# Altium schematic sheet MotorCell.SchDoc
size A3; SheetNumber: 2
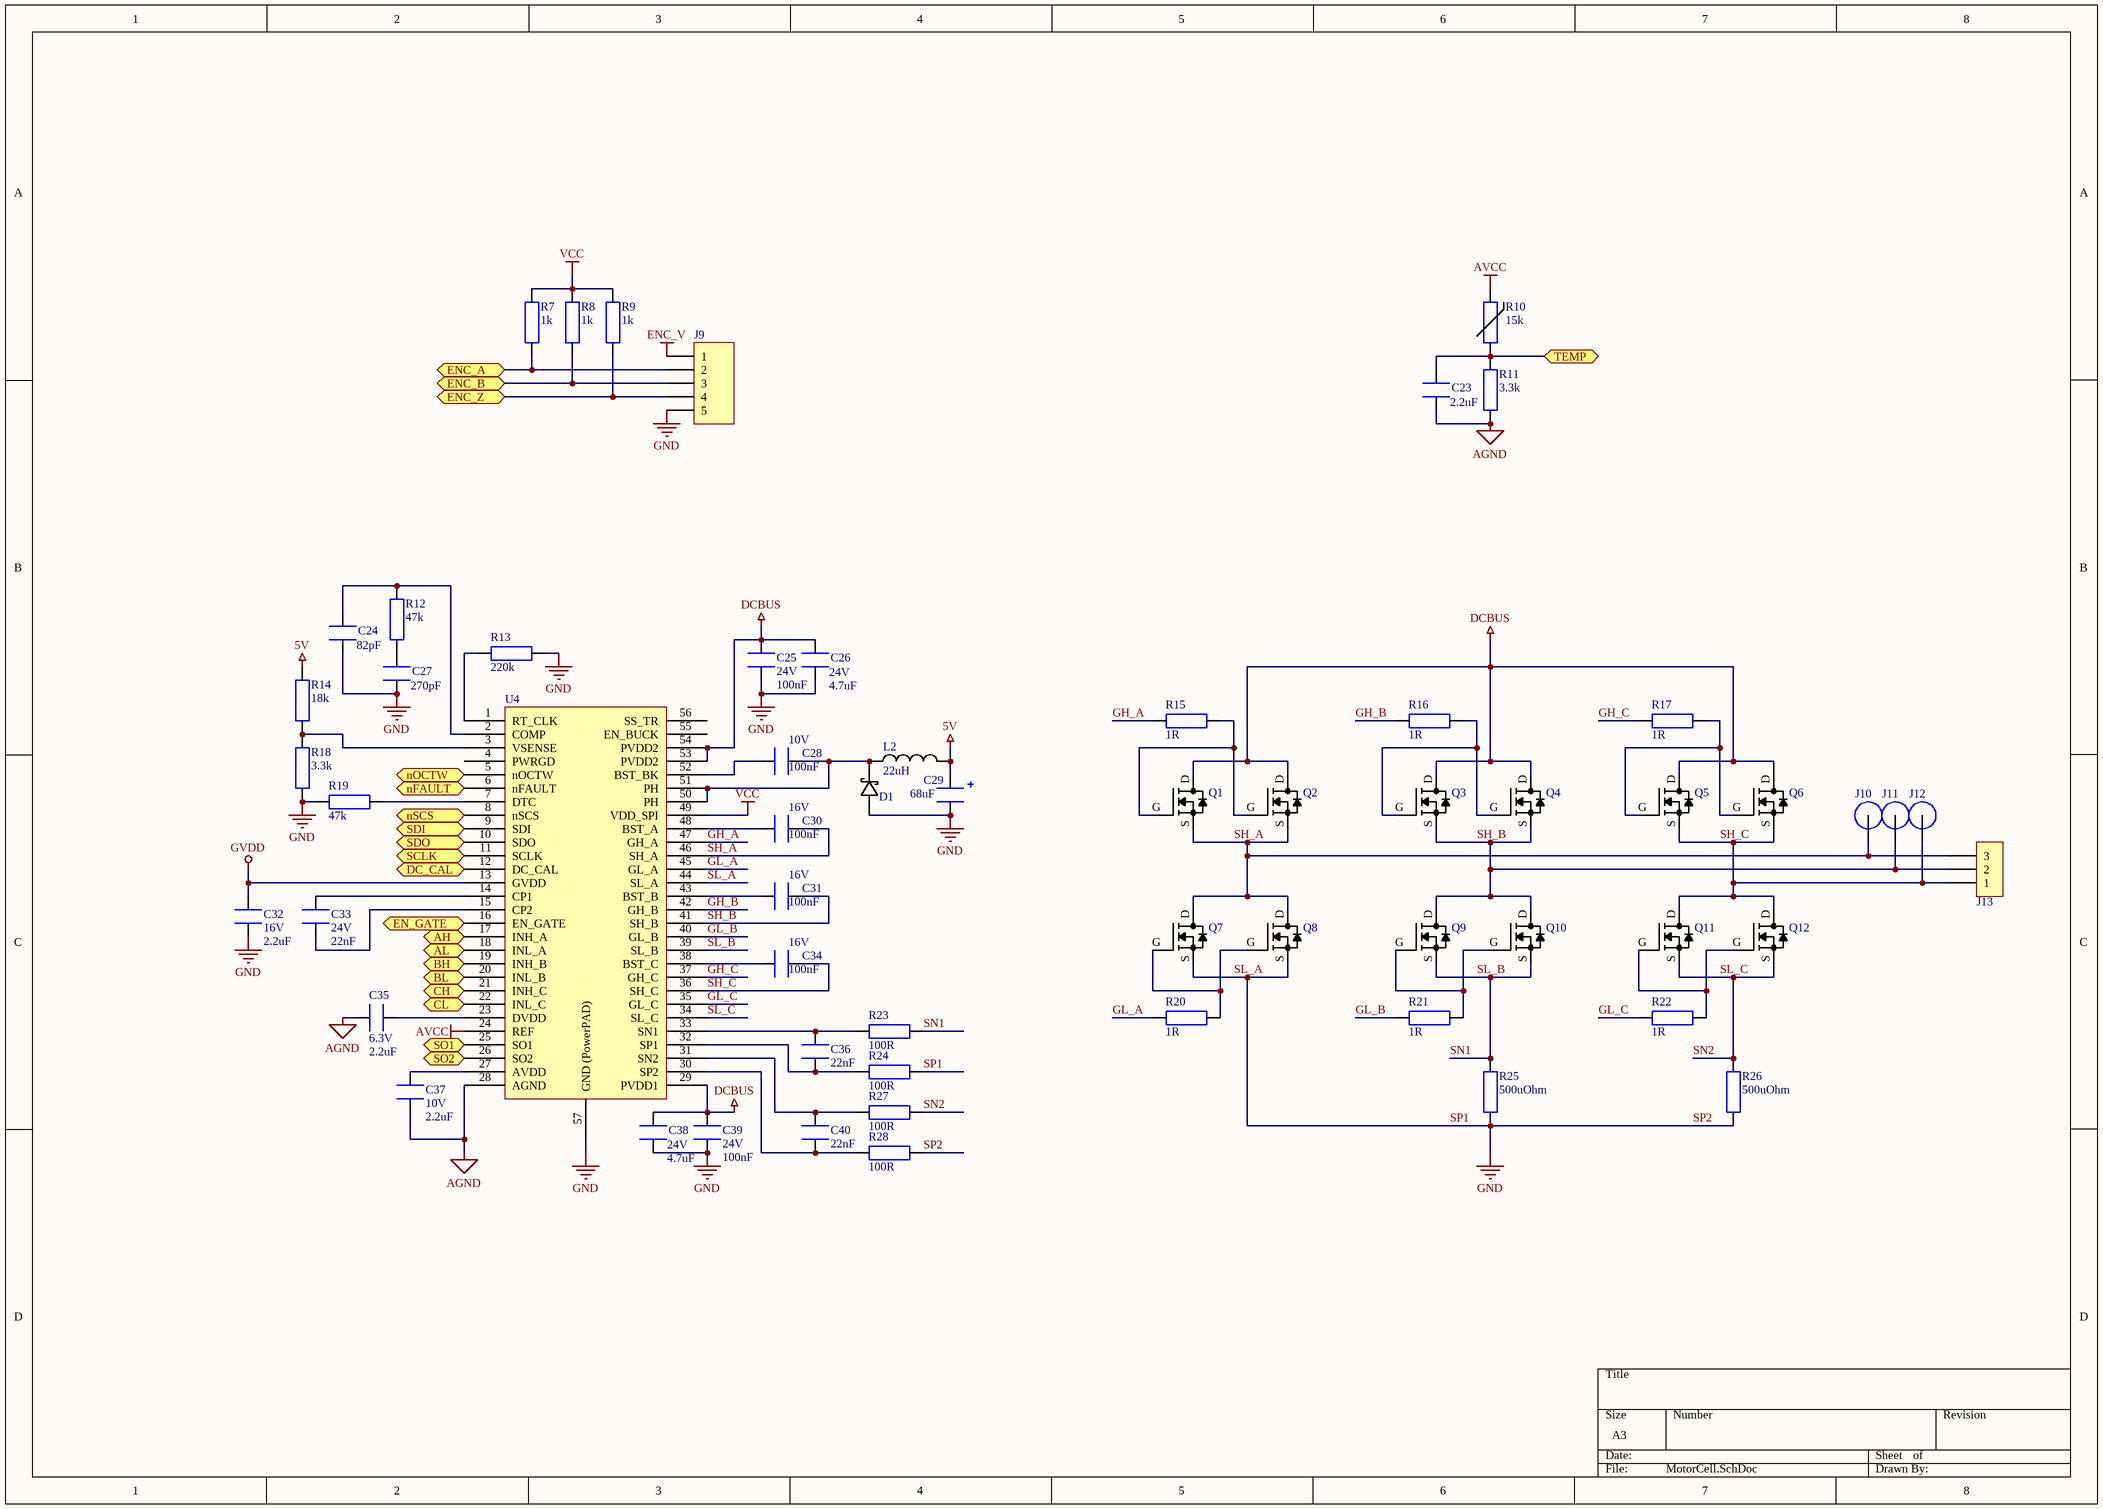
[diagram p0: MotorCell.SchDoc]

## Parts
C23  value 2.2uF  [1608[0603]]
C24  value 82pF  [1608[0603]]
C25  24V  value 100nF  [1608[0603]]
C26  24V  value 4.7uF  [CAPC2012X09N]
C27  value 270pF  [1608[0603]]
C28  10V  value 100nF  [1608[0603]]
C29  value 68uF  [CAPCP6032X28N]
C30  16V  value 100nF  [1608[0603]]
C31  16V  value 100nF  [1608[0603]]
C32  16V  value 2.2uF  [1608[0603]]
C33  24V  value 22nF  [1608[0603]]
C34  16V  value 100nF  [1608[0603]]
C35  6.3V  value 2.2uF  [1608[0603]]
C36  value 22nF  [1608[0603]]
C37  10V  value 2.2uF  [1608[0603]]
C38  24V  value 4.7uF  [CAPC2012X09N]
C39  24V  value 100nF  [1608[0603]]
C40  value 22nF  [1608[0603]]
D1  (no value)  [DO-214AA]
J9  (no value)  [HDR1X5]
J10  (no value)  [M3 Spade Hole]
J11  (no value)  [M3 Spade Hole]
J12  (no value)  [M3 Spade Hole]
J13  (no value)  [MC000051]
L2  value 22uH  [INDC6060X28N]
Q1  (no value)  [SO8FL]
Q2  (no value)  [SO8FL_FILL]
Q3  (no value)  [SO8FL]
Q4  (no value)  [SO8FL_FILL]
Q5  (no value)  [SO8FL]
Q6  (no value)  [SO8FL_FILL]
Q7  (no value)  [SO8FL]
Q8  (no value)  [SO8FL]
Q9  (no value)  [SO8FL]
Q10  (no value)  [SO8FL]
Q11  (no value)  [SO8FL]
Q12  (no value)  [SO8FL]
R7  value 1k  [RESC1608X55N]
R8  value 1k  [RESC1608X55N]
R9  value 1k  [RESC1608X55N]
R10  value 15k  [RESC1608X06L]
R11  value 3.3k  [RESC1608X55N]
R12  value 47k  [RESC1608X55N]
R13  value 220k  [RESC1608X55N]
R14  value 18k  [RESC1608X55N]
R15  value 1R  [RESC1608X55N]
R16  value 1R  [RESC1608X55N]
R17  value 1R  [RESC1608X55N]
R18  value 3.3k  [RESC1608X55N]
R19  value 47k  [RESC1608X55N]
R20  value 1R  [RESC1608X55N]
R21  value 1R  [RESC1608X55N]
R22  value 1R  [RESC1608X55N]
R23  value 100R  [RESC1608X55N]
R24  value 100R  [RESC1608X55N]
R25  value 500uOhm  [RESC6432X09N]
R26  value 500uOhm  [RESC6432X09N]
R27  value 100R  [RESC1608X55N]
R28  value 100R  [RESC1608X55N]
U4  (no value)  [TSSOP50P810X120_HS-57N]

## Ports
AH, AL, BH, BL, CH, CL, DC_CAL, EN_GATE, ENC_A, ENC_B, ENC_Z, nFAULT, nOCTW, nSCS, SCLK, SDI, SDO, SO1, SO2, TEMP

## Nets
5V: C29.1 L2.2 R14.1
AGND: C23.1 C35.1 C37.1 R11.2 U4.28(AGND)
AVCC: R10.2 U4.24(REF)
DCBUS: C25.1 C26.2 C38.2 C39.1 Q1.D Q2.D Q3.D Q4.D Q5.D Q6.D U4.29(PVDD1) U4.53(PVDD2) U4.54(PVDD2)
ENC_V: J9.1
GVDD: C32.2 U4.13(GVDD)
SL_A: C24.2 C25.2 C26.1 C27.2 C29.2 C32.1 C38.1 C39.2 D1.A J9.5 Q7.S Q8.S R13.2 R18.2 R19.2 R24.1 R25.1 R26.1 R28.1 U4.44(SL_A) U4.57(GND_(PowerPAD))  [also labelled GND, SP1, SP2]
VCC: R7.1 R8.1 R9.1 U4.49(VDD_SPI)
AH: U4.17(INH_A) ; port AH
AL: U4.18(INL_A) ; port AL
BH: U4.19(INH_B) ; port BH
BL: U4.20(INL_B) ; port BL
CH: U4.21(INH_C) ; port CH
CL: U4.22(INL_C) ; port CL
DC_CAL: U4.12(DC_CAL) ; port DC_CAL
EN_GATE: U4.16(EN_GATE) ; port EN_GATE
ENC_A: J9.2 R7.2 ; port ENC_A
ENC_B: J9.3 R8.2 ; port ENC_B
ENC_Z: J9.4 R9.2 ; port ENC_Z
GH_A: R15.1 U4.47(GH_A)
GH_B: R16.1 U4.42(GH_B)
GH_C: R17.1 U4.37(GH_C)
GL_A: R20.1 U4.45(GL_A)
GL_B: R21.1 U4.40(GL_B)
GL_C: R22.1 U4.35(GL_C)
nFAULT: U4.6(nFAULT) ; port nFAULT
nOCTW: U4.5(nOCTW) ; port nOCTW
nSCS: U4.8(nSCS) ; port nSCS
SCLK: U4.11(SCLK) ; port SCLK
SDI: U4.9(SDI) ; port SDI
SDO: U4.10(SDO) ; port SDO
SH_A: C30.1 J10.1 J13.3 Q1.S Q2.S Q7.D Q8.D U4.46(SH_A)
SH_B: C31.1 J11.1 J13.2 Q3.S Q4.S Q9.D Q10.D U4.41(SH_B)
SH_C: C34.1 J12.1 J13.1 Q5.S Q6.S Q11.D Q12.D U4.36(SH_C)
SL_B: Q9.S Q10.S R23.1 R25.2 U4.39(SL_B)  [also labelled SN1]
SL_C: Q11.S Q12.S R26.2 R27.1 U4.34(SL_C)  [also labelled SN2]
SO1: U4.25(SO1) ; port SO1
SO2: U4.26(SO2) ; port SO2
TEMP: C23.2 R10.1 R11.1 ; port TEMP
NetC24_1: C24.1 R12.1 U4.2(COMP)
NetC27_1: C27.1 R12.2
NetC28_1: C28.1 D1.K L2.1 U4.50(PH) U4.51(PH)
NetC28_2: C28.2 U4.52(BST_BK)
NetC30_2: C30.2 U4.48(BST_A)
NetC31_2: C31.2 U4.43(BST_B)
NetC33_1: C33.1 U4.14(CP1)
NetC33_2: C33.2 U4.15(CP2)
NetC34_2: C34.2 U4.38(BST_C)
NetC35_2: C35.2 U4.23(DVDD)
NetC36_1: C36.1 R23.2 U4.33(SN1)
NetC36_2: C36.2 R24.2 U4.32(SP1)
NetC37_2: C37.2 U4.27(AVDD)
NetC40_1: C40.1 R27.2 U4.31(SN2)
NetC40_2: C40.2 R28.2 U4.30(SP2)
NetQ1_G: Q1.G Q2.G R15.2
NetQ3_G: Q3.G Q4.G R16.2
NetQ5_G: Q5.G Q6.G R17.2
NetQ7_G: Q7.G Q8.G R20.2
NetQ9_G: Q9.G Q10.G R21.2
NetQ11_G: Q11.G Q12.G R22.2
NetR13_1: R13.1 U4.1(RT_CLK)
NetR14_2: R14.2 R18.1 U4.3(VSENSE)
NetR19_1: R19.1 U4.7(DTC)

Not connected (* = marked no-connect by the designer): U4 4(PWRGD) 55(EN_BUCK) 56(SS_TR)

## Library data of the parts
C23-C25 C27 C28 C30-C37 C39 C40 = CAP_0603: CAP General 0603
C26 C38 = GRM219R6YA475KA73D: CAP CER 4.7UF 35V X5R 0805
C29 = T495C686M016ATE250: CAP TANT 68UF 16V 20% 2312 250mOhm
D1 = SS13B: DIODE, SCHOTTK, RECTIF, 1A, 30V, SMB; Supplier 1: Farnell; Supplier Part Number 1: 1861425
J9 = Header 5: Header, 5-Pin; LatestRevisionDate: 17-Jul-2002; LatestRevisionNote: Re-released for DXP Platform.; Publisher: Altium Limited
J10-J12 = M3 Spade Terminal
J13 = MC000051: TERMINAL BLOCK, WIRE TO BRD, 3POS, 10AWG; Supplier 1: Farnell; Supplier Part Number 1: 2008022
L2 = NR6028T220M: INDUCTOR 22UH 1.4A 175.5 MOHM
Q1-Q12 = NTMFS4937NT1G: MOSFET, N CH, 30V, 70A, SO-8 FL; Supplier 1: Farnell; Supplier Part Number 1: 2317605; Supplier 2: Farnell; Supplier Part Number 2: 2317605RL
R7-R9 R11-R24 R27 R28 = RES_0603: RES General 1% 0603
R10 = NTCS0603E3153JMT: THERMISTOR, 15K, 5%, SMD, NTC; Supplier 1: Farnell; Supplier Part Number 1: 2103168
R25 R26 = CSR2512C0R0005F: RES SMD 0.0005 OHM 1% 3W 2512
U4 = DRV8301: MOTOR DRIVER, 3PH, 56HTSSOP